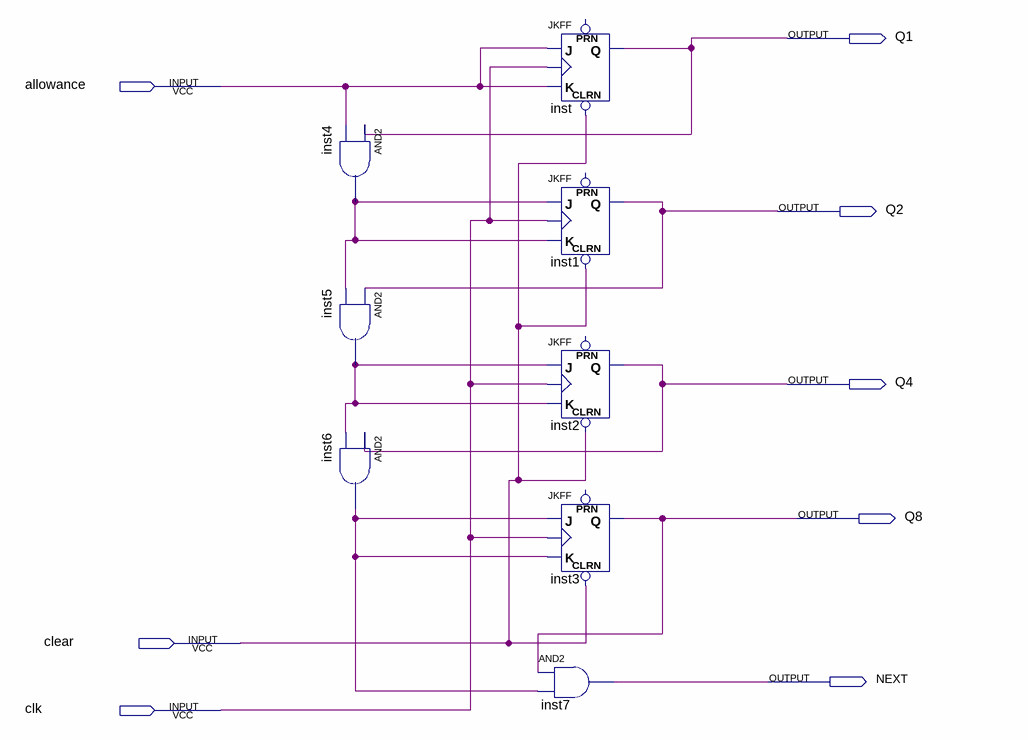
[diagram p0: schematic sheet]
// Quartus schematic askisi2.bdf as structural Verilog: 8 symbols, 8 pins
module askisi2 (
  input  allowance,
  input  clear,
  input  clk,
  output Q1,
  output Q2,
  output Q4,
  output Q8,
  output NEXT
);

  wire inst4_out, inst5_out, inst6_out;

  and inst4 (inst4_out, Q1, allowance);
  and inst5 (inst5_out, Q2, inst4_out);
  and inst6 (inst6_out, Q4, inst5_out);
  JKFF inst (.CLRN(clear), .K(allowance), .J(allowance), .CLK(clk), .Q(Q1));  // open: PRN
  JKFF inst1 (.CLRN(clear), .K(inst4_out), .J(inst4_out), .CLK(clk), .Q(Q2));  // open: PRN
  JKFF inst2 (.CLRN(clear), .K(inst5_out), .J(inst5_out), .CLK(clk), .Q(Q4));  // open: PRN
  JKFF inst3 (.CLRN(clear), .K(inst6_out), .J(inst6_out), .CLK(clk), .Q(Q8));  // open: PRN
  and inst7 (NEXT, Q8, inst6_out);
endmodule
